# EAGLE design USB_to_NABU_Converter_v37 (EAGLE 9.7.0)
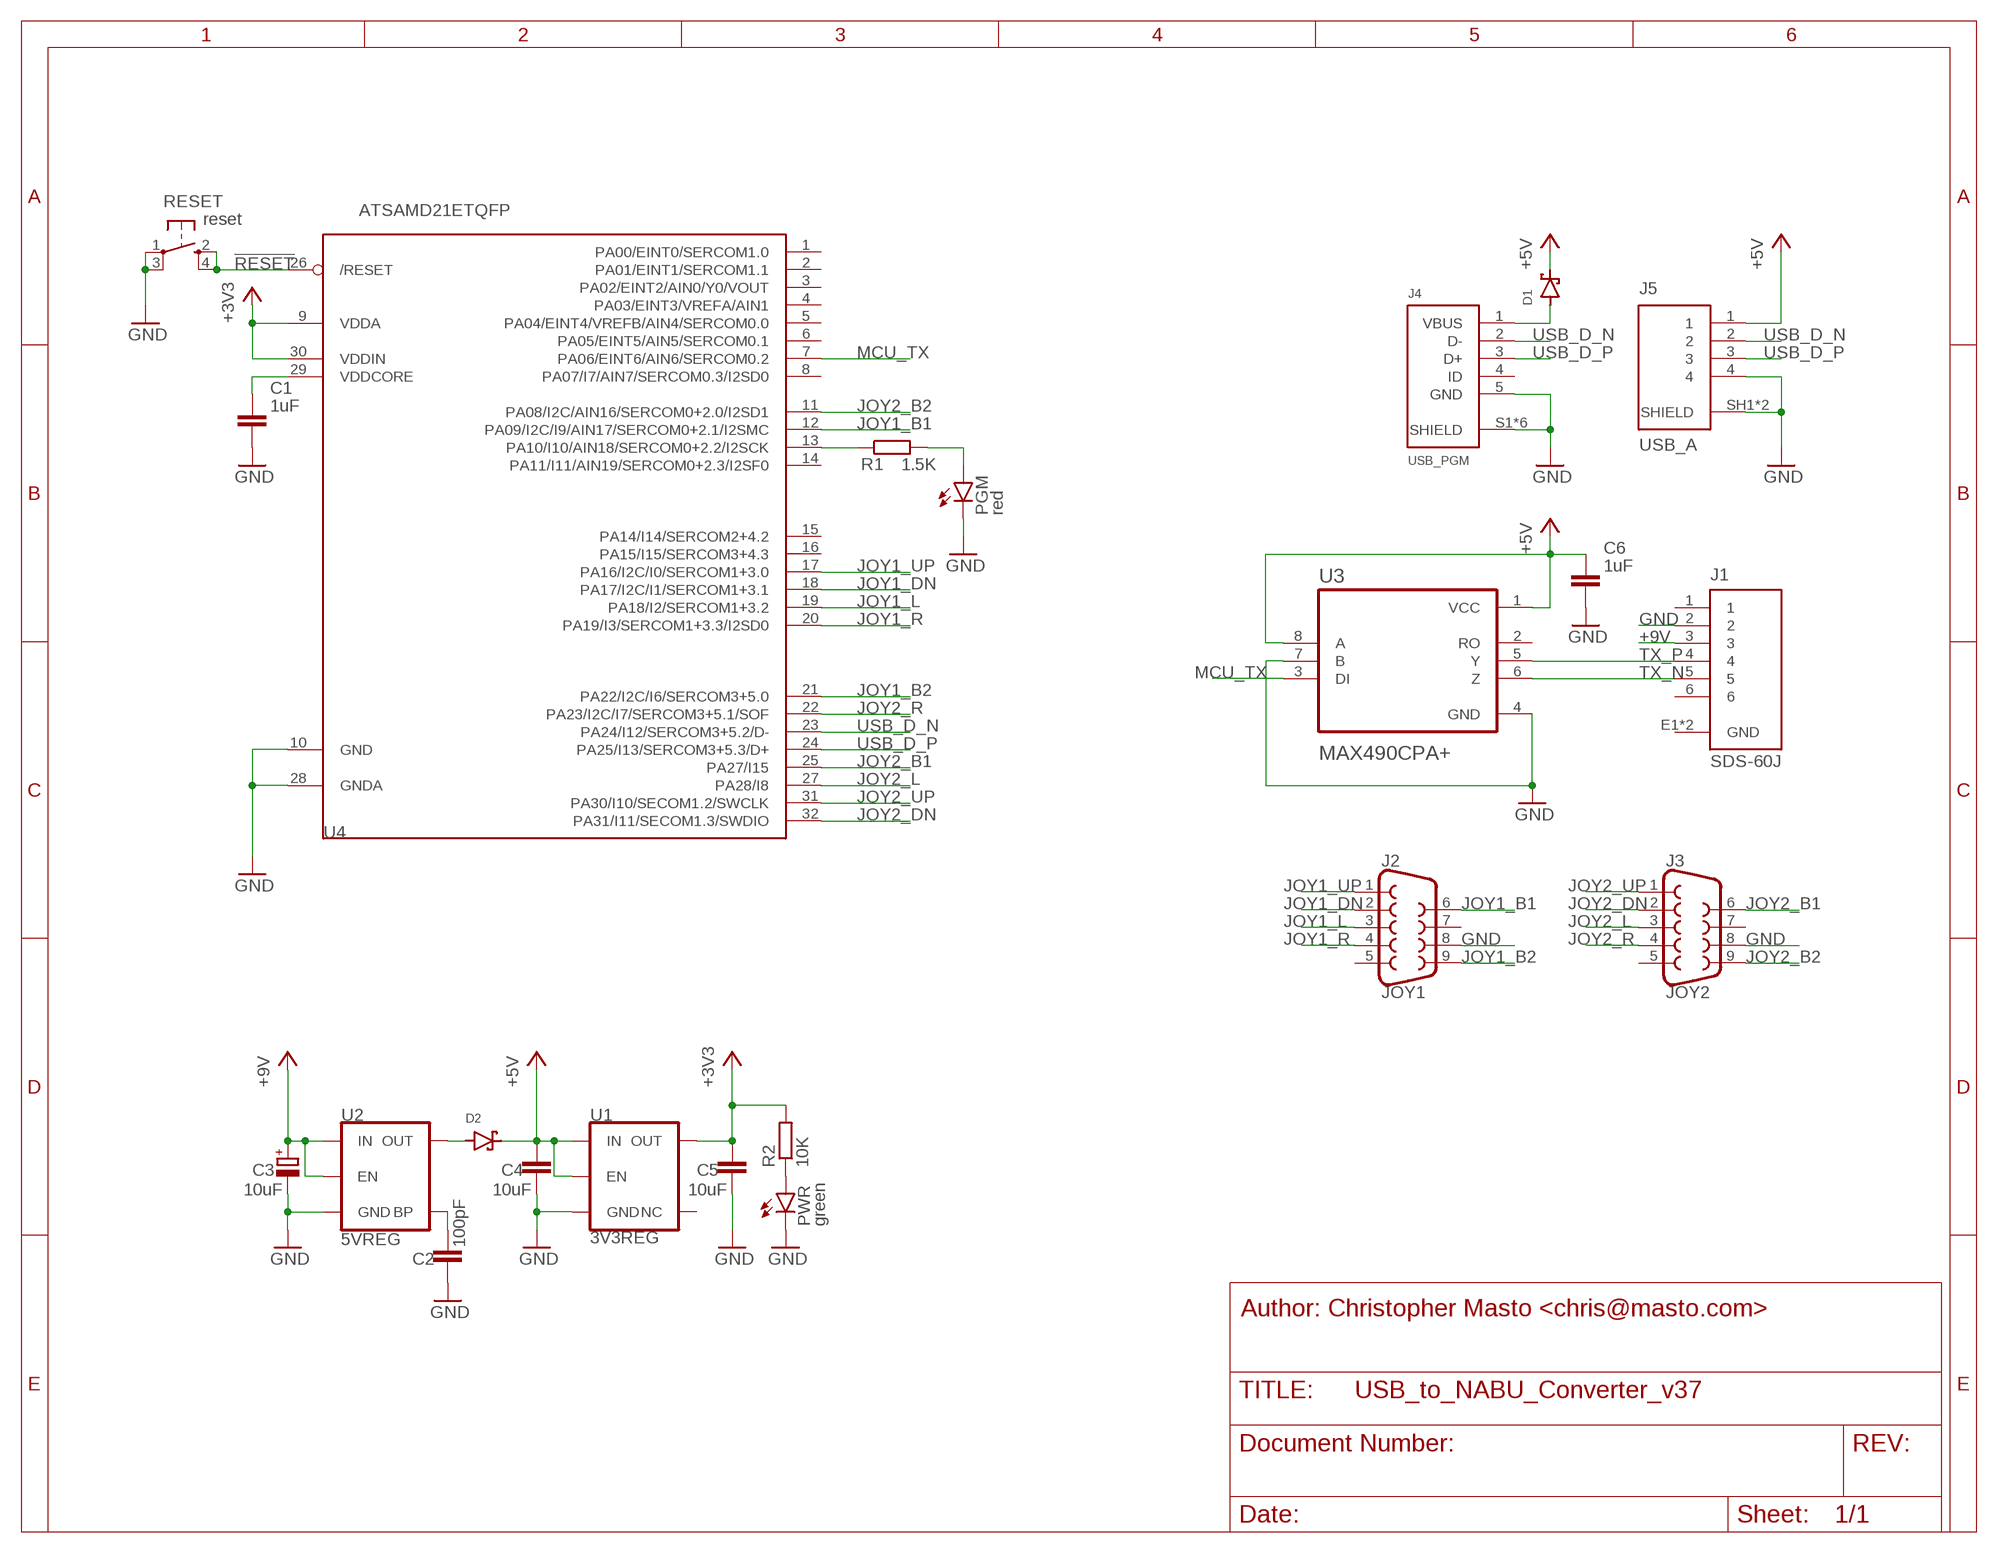
[diagram p0: schematic, sheet 1]

## Parts
C1  1uF  C_CHIP-0603(1608-METRIC)  [CAPC1608X85]
C2  100pF  C_CHIP-0603(1608-METRIC)  [CAPC1608X85]
C3  10uF  PCX1V100MCL1GS  [UD-6,3X5,8_NICHICON]
C4  10uF  C_CHIP-0603(1608-METRIC)  [CAPC1608X85]
C5  10uF  C_CHIP-0603(1608-METRIC)  [CAPC1608X85]
C6  1uF  C_CHIP-0603(1608-METRIC)  [CAPC1608X85]
D1  MBR0520LT1G  SCHOTTKY_MBR0520LT1GDO-219  [SODFL3718X115]
D2  MBR0520LT1G  SCHOTTKY_MBR0520LT1GDO-219  [SODFL3718X115]
J1  SDS-60J  [CUI_SDS-60J]
J2  JOY1  DB9MALE  [DB9_MALE]
J3  JOY2  DB9MALE  [DB9_MALE]
J4  USB_PGM  AMPHENOL_10118194-0001LF  [AMPHENOL_10118194-0001LF]
J5  USB_A  292303-1  [292303-1]
PGM  red  LEDCHIP-LED0603  [CHIP-LED0603]
PWR  green  LEDCHIP-LED0603  [CHIP-LED0603]
R1  1.5K  R-EU_R0603  [R0603]
R2  10K  R-EU_R0603  [R0603]
RESET  reset  SPST_TACT-KMR2  [KMR2]
U1  3V3REG  AP2112K  [SOT23-5]
U2  5VREG  AP2210KAP2210K  [SOT23-5]
U3  MAX490CPA+  [DIP794W47P254L991H457Q8]
U4  ATSAMD21ETQFP  [QFP80P900X900X120-32]

## Nets
!RESET: RESET.2(S) RESET.4(S1) U4.26(/RESET)
+3V3: C5.1 R2.2 U1.5(OUT) U4.9(VDDA) U4.30(VDDIN)
+5V: C4.1 C6.1 D1.1(C) D2.1(C) J5.1 U1.1(IN) U1.3(EN) U3.1(VCC) U3.8(A)
+9V: C3.+ J1.3 U2.1(IN) U2.3(EN)
GND: C1.2 C2.2 C3.- C4.2 C5.2 C6.2 J1.2 J2.8 J3.8 J4.5(GND) J4.S1(SHIELD) J4.S2(SHIELD) J4.S3(SHIELD) J4.S4(SHIELD) J4.S5(SHIELD) J4.S6(SHIELD) J5.4 J5.SH1(SHIELD) J5.SH2(SHIELD) PGM.C PWR.C RESET.1(P) RESET.3(P1) U1.2(GND) U2.2(GND) U3.4(GND) U3.7(B) U4.10(GND) U4.28(GNDA)
JOY1_B1: J2.6 U4.12(PA09/I2C/I9/AIN17/SERCOM0+2.1/I2SMC)
JOY1_B2: J2.9 U4.21(PA22/I2C/I6/SERCOM3+5.0)
JOY1_DN: J2.2 U4.18(PA17/I2C/I1/SERCOM1+3.1)
JOY1_L: J2.3 U4.19(PA18/I2/SERCOM1+3.2)
JOY1_R: J2.4 U4.20(PA19/I3/SERCOM1+3.3/I2SD0)
JOY1_UP: J2.1 U4.17(PA16/I2C/I0/SERCOM1+3.0)
JOY2_B1: J3.6 U4.25(PA27/I15)
JOY2_B2: J3.9 U4.11(PA08/I2C/AIN16/SERCOM0+2.0/I2SD1)
JOY2_DN: J3.2 U4.32(PA31/I11/SECOM1.3/SWDIO)
JOY2_L: J3.3 U4.27(PA28/I8)
JOY2_R: J3.4 U4.22(PA23/I2C/I7/SERCOM3+5.1/SOF)
JOY2_UP: J3.1 U4.31(PA30/I10/SECOM1.2/SWCLK)
MCU_TX: U3.3(DI) U4.7(PA06/EINT6/AIN6/SERCOM0.2)
N$1: PWR.A R2.1
N$2: C1.1 U4.29(VDDCORE)
N$3: R1.1 U4.13(PA10/I10/AIN18/SERCOM0+2.2/I2SCK)
N$4: PGM.A R1.2
N$5: C2.1 U2.4(BP)
N$6: D1.2(A) J4.1(VBUS)
N$7: D2.2(A) U2.5(OUT)
TX_N: J1.5 U3.6(Z)
TX_P: J1.4 U3.5(Y)
USB_D_N: J4.2(D-) J5.2 U4.23(PA24/I12/SERCOM3+5.2/D-)
USB_D_P: J4.3(D+) J5.3 U4.24(PA25/I13/SERCOM3+5.3/D+)
Unconnected: J1.1 J1.6 J2.5 J2.7 J3.5 J3.7 J4.4(ID) U1.4(NC) U3.2(RO) U4.1(PA00/EINT0/SERCOM1.0) U4.2(PA01/EINT1/SERCOM1.1) U4.3(PA02/EINT2/AIN0/Y0/VOUT) U4.4(PA03/EINT3/VREFA/AIN1) U4.5(PA04/EINT4/VREFB/AIN4/SERCOM0.0) U4.6(PA05/EINT5/AIN5/SERCOM0.1) U4.8(PA07/I7/AIN7/SERCOM0.3/I2SD0) U4.14(PA11/I11/AIN19/SERCOM0+2.3/I2SF0) U4.15(PA14/I14/SERCOM2+4.2) U4.16(PA15/I15/SERCOM3+4.3)

## Notes on the sheet
- Author: Christopher Masto <chris@masto.com>

## Power pins joined to a net without a drawn wire
GND: J1.E1(GND) J1.E2(GND)

## Library data of the parts
C1 C2 C4-C6 = Capacitor:C: Capacitor - Generic; CATEGORY: Capacitor
C3 = NABU USB Converter Parts:PCX1V100MCL1GS
D1 D2 = Diode:SCHOTTKY_: Schottky Diode - Popular parts; CATEGORY: Diode; DESCRIPTION: DIODE SCHOTTKY 20V 500MA SOD123; MANUFACTURER: ON Semiconductor; MPN: MBR0520LT1G; SUB-CATEGORY: Schottky
J1 = NABU USB Converter Parts:SDS-60J; MANUFACTURER: CUI Devices; MAXIMUM_PACKAGE_HEIGHT: 21.40mm; PARTREV: 1.06/02-13-2020; STANDARD: Manufacturer Recommendations
J2 J3 = NABU USB Converter Parts:DB9: DB9 Connector Standard DB9 (D-Sub 9) serial connector. Can be used for CAN bus as well as RS485 and RS232. Footprint production proven. Here is the female version connector we sell at SparkFun: 9 Pin Female Serial Connector - PCB Mount <https://www.sparkfun.com/products/429> (PRT-00429) This connector has been used on the following SparkFun products: SparkFun RS232 Shifter - SMD <https://www.sparkfun.com/products/449> (PRT-00449) SparkFun RS232 Shifter SMD (No DB9) <https://www.sparkfun.com/products/8780> (PRT-08780); PROD_ID: CONN-09904
J4 = NABU USB Converter Parts:AMPHENOL_10118194-0001LF: CONN RCPT USB2.0 MICRO B SMD R/A Manufacturer's datasheet <https://www.amphenol-icc.com/media/wysiwyg/files/drawing/10118194.pdf?__cf_chl_jschl_tk__=1e9b4569481076e99900b246ea640525553a7b60-1588047333-0-AZhEk6D50lwOf6CdaXmV1teudqMKHMxqtb1pEtnUtu77sOc-OVRjbCmHdORomVnr0W49D2E8XkcMdJ2SdWt5rDDYIblyJz7fSv-zilM8vQKAQDC1Z9aMVORhnMgYjPDuz8XpfDLul_eaqqFpemo1xIgoZv50WTuLMwu26ci7e02s9PWvR3z1cDqm9GMGYIPwIUd9yh5-TtN_o6DbEkadC7zoJlhYZSw-VEaYzfWnBSFg_n44fbEB3slHLR2YKLSiTmh8RSwpxKUP4gER0KeVoie9w-Ibtx3oKQbsZjrsPLGSu9BzV2nf3QeoErALCQuycvY9WhQdebLIpxaon6SXufpVIIdoKZHRpjuVVlAkUIr9oSIZGQzzOWY1-dWY48jVEOvnvoxw9-xup5uFcr7XWo0>
J5 = USB connector:292303-1: CONN RCPT USB2.0 TYPEA 4POS R/A Manufacturer's datasheet <https://www.te.com/commerce/DocumentDelivery/DDEController?Action=srchrtrv&DocNm=292303&DocType=Customer+Drawing&DocLang=English>; CREATED_BY: PCBLayout.com; DIGIKEY_PARTNO: A31726-ND; MANUFACTURER: TE Connectivity AMP Connectors; MPN: 292303-1
PGM PWR = led:LED: LED OSRAM: - CHIPLED LG R971, LG N971, LY N971, LG Q971, LY Q971, LO R971, LY R971 LH N974, LH R974 LS Q976, LO Q976, LY Q976 LO Q996 - Hyper CHIPLED LW Q18S LB Q993, LB Q99A, LB R99A - SideLED LS A670, LO A670, LY A670, LG A670, LP A670 LB A673, LV A673, LT A673, LW A673 LH A674 LY A675 LS A676, LA A676, LO A676, LY A676, LW A676 LS A679, LY A679, LG A679 - Hyper Micro SIDELED® LS Y876, LA Y876, LO Y876, LY Y876 LT Y87S - SmartLED LW L88C, LW L88S LB L89C, LB L89S, LG L890 LS L89K, LO L89K, LY L89K LS L896, LA L896, LO L896, LY L896 - TOPLED LS T670, LO T670, LY T670, LG T670, LP T670 LSG T670, LSP T670, LSY T670, LOP T670, LYG T670 LG T671, LOG T671, LSG T671 LB T673, LV T673, LT T673, LW T673 LH T674 LS T676, LA T676, LO T676, LY T676, LB T676, LH T676, LSB T676, LW T676 LB T67C, LV T67C, LT T67C, LS T67K, LO T67K, LY T67K, LW E67C LS E67B, LA E67B, LO E67B, LY E67B, LB E67C, LV E67C, LT E67C LW T67C LS T679, LY T679, LG T679 LS T770, LO T770, LY T770, LG T770, LP T770 LB T773, LV T773, LT T773, LW T773 LH T774 LS E675, LA E675, LY E675, LS T675 LS T776, LA T776, LO T776, LY T776, LB T776 LHGB T686 LT T68C, LB T68C - Hyper Mini TOPLED® LB M676 - Mini TOPLED Santana® LG M470 LS M47K, LO M47K, LY M47K Source: http://www.osram.convergy.de LUXEON: - LUMILED® LXK2-PW12-R00, LXK2-PW12-S00, LXK2-PW14-U00, LXK2-PW14-V00 LXK2-PM12-R00, LXK2-PM12-S00, LXK2-PM14-U00 LXK2-PE12-Q00, LXK2-PE12-R00, LXK2-PE12-S00, LXK2-PE14-T00, LXK2-PE14-U00 LXK2-PB12-K00, LXK2-PB12-L00, LXK2-PB12-M00, LXK2-PB14-N00, LXK2-PB14-P00, LXK2-PB14-Q00 LXK2-PR12-L00, LXK2-PR12-M00, LXK2-PR14-Q00, LXK2-PR14-R00 LXK2-PD12-Q00, LXK2-PD12-R00, LXK2-PD12-S00 LXK2-PH12-R00, LXK2-PH12-S00 LXK2-PL12-P00, LXK2-PL12-Q00, LXK2-PL12-R00 Source: www.luxeon.com KINGBRIGHT: KA-3528ASYC Source: www.kingbright.com
R1 R2 = rcl:R-EU_: RESISTOR, European symbol; SPICEPREFIX: R
RESET = NABU USB Converter Parts:SPST_TACT: SMT 6mm switch, EVQQ2 series http://www.ladyada.net/library/eagle
U1 = NABU USB Converter Parts:AP2112K
U2 = NABU USB Converter Parts:AP2210K; VALUE: 5V
U3 = MAX490CPA_:MAX490CPA+: None; AVAILABILITY: Unavailable; DESCRIPTION: MAX490 Series 2.5 Mbps 5.25 V Full Duplex RS-485/RS-422 Transceiver - PDIP-8; MF: Maxim Integrated; MP: MAX490CPA+; PACKAGE: PDIP-8 Maxim; PRICE: None
U4 = NABU USB Converter Parts:ATSAMD21E

## Board
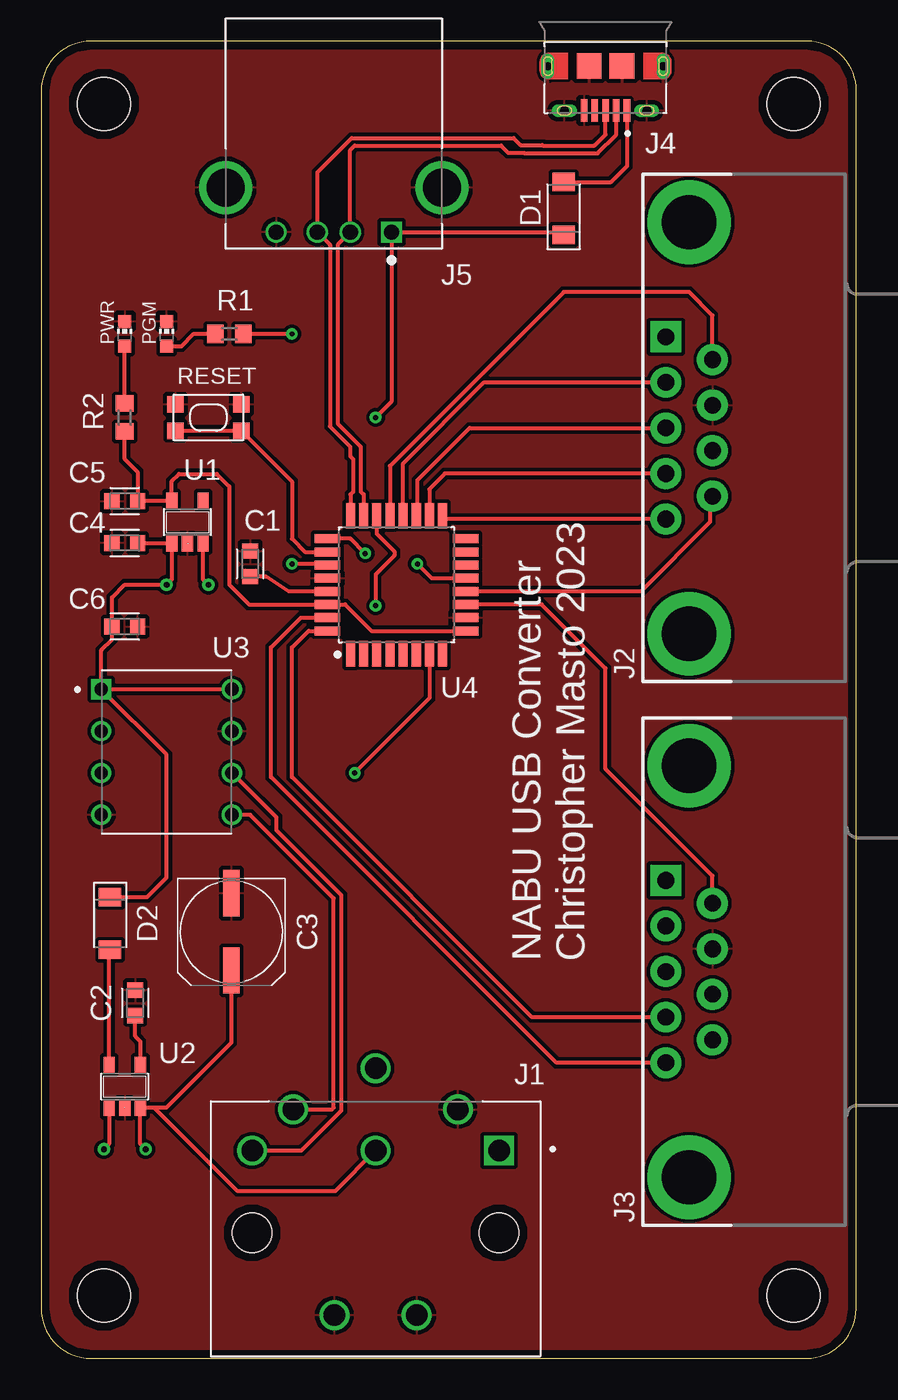
[diagram p1: board, top side]
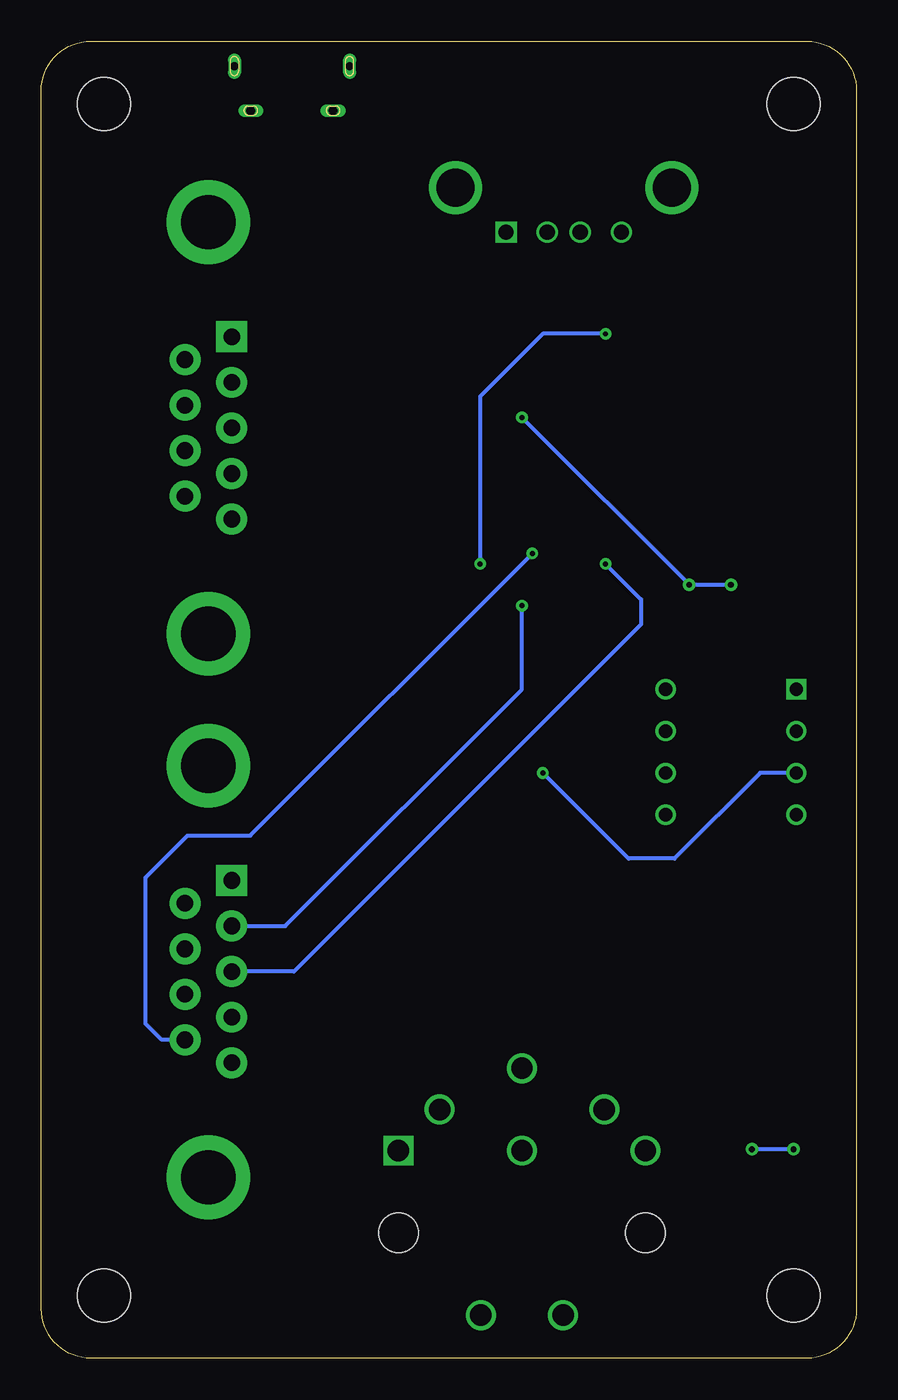
[diagram p2: board, bottom side, seen from below]

Size 49.53 x 80.01 mm. Coordinates in mm from the lower left corner, seen from the top.
Outline: 0,77.01 0,3 arc90 3,0 46.51,0 arc90 49.51,3 49.53,77.01 arc90 46.53,80.01 3,80.01 arc90 0,77.01
Copper layers (1*16): Top / Bottom
Stack-up Default Layer Stack: Top User Defined 0.035mm / Dielectric-1 User Defined 1.5mm / Bottom User Defined 0.035mm
Design rules "default(39305442-2) *": minimum track width 10mil, minimum drill 0.3mm, track to track 0.205mm, track to pad 0.205mm, pad to pad 0.205mm, via to via 0.205mm, smd to smd 8mil, copper to edge 20mil, drill to drill 8mil, minimum pad ring 4mil, minimum via ring 8mil, stop-mask expansion 4mil, vias tented up to drill 25mil, thermal gap 10mil
Holes 3.2 mm at 45.72,76.2 3.81,76.2 3.81,3.81 45.72,3.81

### Footprints (pad centres in the part's own frame; a part is rotated, then mirrored left to right if it is on the bottom)
CAPC1608X85 = smd 0.921 x 0.97: 1 -0.775,0; 2 0.775,0
UD-6,3X5,8_NICHICON = smd 2.8 x 1: + 2.35,0; - -2.35,0
SODFL3718X115 = smd 1.115 x 1.361: 1 -1.6,0; 2 1.6,0
CUI_SDS-60J = drill 1.3 square: 1 7.5,5 | drill 1.3: 2 5,7.5; 3 0,5; 4 -5,7.5; 5 -7.5,5; 6 0,10; E1 -2.5,-5; E2 2.5,-5 | hole 2.4: 7.5,0; -7.5,0
DB9_MALE = drill 1.016 pad 1.88: 1 5.54,-1.42; 2 2.77,-1.42; 3 0,-1.42; 4 -2.77,-1.42; 6 4.15,1.42; 7 1.38,1.42; 8 -1.38,1.42; 9 -4.15,1.42 | drill 1.016 pad 1.88 square: 5 -5.54,-1.42 | drill 3.302 pad 5.08: G1 -12.5,0; G2 12.5,0
AMPHENOL_10118194-0001LF = smd 0.4 x 1.35: 1 -1.3,2.7; 2 -0.65,2.7; 3 0,2.7; 4 0.65,2.7; 5 1.3,2.7 | drill 0.55 pad 0.65 long: S1 -2.5,2.7; S2 2.5,2.7 | drill 0.5 pad 0.775 long: S3 -3.5,0; S6 3.5,0 | smd 1.5 x 1.55: S4 -1,0; S5 1,0
292303-1 = drill 0.92 square: 1 -3.5,2.71 | drill 0.92: 2 -1,2.71; 3 1,2.71; 4 3.5,2.71 | drill 2.3: SH1 -6.57,0; SH2 6.57,0
CHIP-LED0603 = smd 0.8 x 0.8: A 0,-0.75; C 0,0.75
R0603 = smd 1 x 1.1: 1 -0.85,0; 2 0.85,0
KMR2 = smd 1 x 1: 1 2,0.8; 2 2,-0.8; 3 -2,0.8; 4 -2,-0.8
SOT23-5 = smd 0.69 x 0.99: 1 -0.95,-1.29; 2 0,-1.29; 3 0.95,-1.29; 4 0.95,1.3; 5 -0.95,1.3
DIP794W47P254L991H457Q8 = drill 0.81 pad 1.22 square: 1 -3.97,3.81 | drill 0.81 pad 1.22: 2 -3.97,1.27; 3 -3.97,-1.27; 4 -3.97,-3.81; 5 3.97,-3.81; 6 3.97,-1.27; 7 3.97,1.27; 8 3.97,3.81
QFP80P900X900X120-32 = smd 1.55 x 0.55: 1 -4.2,2.8; 2 -4.2,2; 3 -4.2,1.2; 4 -4.2,0.4; 5 -4.2,-0.4; 6 -4.2,-1.2; 7 -4.2,-2; 8 -4.2,-2.8; 17 4.2,-2.8; 18 4.2,-2; 19 4.2,-1.2; 20 4.2,-0.4; 21 4.2,0.4; 22 4.2,1.2; 23 4.2,2; 24 4.2,2.8 | smd 0.55 x 1.55: 9 -2.8,-4.2; 10 -2,-4.2; 11 -1.2,-4.2; 12 -0.4,-4.2; 13 0.4,-4.2; 14 1.2,-4.2; 15 2,-4.2; 16 2.8,-4.2; 25 2.8,4.2; 26 2,4.2; 27 1.2,4.2; 28 0.4,4.2; 29 -0.4,4.2; 30 -1.2,4.2; 31 -2,4.2; 32 -2.8,4.2

### Placement (x,y rotation side)
C1  12.7,48.26 90 top
C2  5.71,21.59 90 top
C3  11.56,25.91 270 top
C4  5.08,49.53 180 top
C5  5.08,52.07 180 top
C6  5.08,44.45 0 top
D1  31.75,69.85 90 top
D2  4.19,26.42 270 top
J1  20.32,7.62 0 top
J2  39.37,56.52 270 top
J3  39.37,23.5 270 top
J4  34.29,78.49 180 top
J5  17.78,71.12 180 top
PGM  7.62,62.23 0 top
PWR  5.08,62.23 0 top
R1  11.43,62.23 180 top
R2  5.08,57.15 270 top
RESET  10.16,57.15 0 top
U1  8.89,50.8 0 top
U2  5.08,16.51 0 top
U3  7.62,36.83 0 top
U4  21.59,46.99 90 top

### Tracks (layer width: path | path; a pad name or v marks a point on that pad's centre or on a via)
!RESET
  Top 0.254: U4.26 16.03,48.99 15.24,49.78 15.24,53.27 RESET.2 RESET.4
+3V3
  Top 0.254: R2.2 5.08,54.61 5.86,53.84 C5.1 5.88,52.1 U1.5 7.94,53.28 8.38,53.72 10.67,53.72 11.43,52.96 11.43,46.99 12.63,45.79 U4.30 18.47,45.79 20.07,44.19 U4.9
+5V  (via drill 0.3, 0.35)
  Top 0.254: C4.1 7.92,49.53 U1.1 7.94,47.31 v7.62,46.99 5.08,46.99 4.3,46.22 C6.1 4.3,43.67 3.65,43.02 U3.1 | U1.3 9.84,47.31 v10.16,46.99 | D2.1 6.43,28.02 7.62,29.21 7.62,36.67 U3.1 | U3.8 U3.1 | D1.1 31.59,68.41 J5.1 21.28,58.11 v20.32,57.15
  Bottom 0.254: v7.62,46.99 v10.16,46.99 v20.32,57.15
+9V  (via drill 0.35)
  Top 0.254: v6.35,12.7 6.03,13.02 U2.3 6.88,15.22 | U2.1 4.13,13.02 v3.81,12.7 | J1.3 17.86,10.16 11.94,10.16 6.88,15.22 | C3.+ 11.56,19.18 7.6,15.22 6.88,15.22
  Bottom 0.254: v3.81,12.7 v6.35,12.7
GND
  pour Top: 3,80.01 46.53,80.01 arc-90 49.53,77.01 49.51,3 arc-90 46.51,0 3,0 arc-90 0,3 0,77.01 arc-90
JOY1_B1
  Top 0.254: J2.6 40.64,52.22 40.64,50.8 36.43,46.59 U4.12
JOY1_B2
  Top 0.254: J2.9 40.79,63.35 39.37,64.77 31.75,64.77 21.19,54.21 U4.21
JOY1_DN
  Top 0.254: J2.2 24.54,53.74 23.59,52.8 U4.18
JOY1_L
  Top 0.254: U4.19 22.86,51.26 22.86,53.34 26.04,56.52 J2.3
JOY1_R
  Top 0.254: U4.20 21.99,54.36 26.91,59.28 J2.4
JOY1_UP
  Top 0.254: J2.1 24.61,50.98 U4.17
JOY2_B1  (via drill 0.3)
  Top 0.254: v19.68,48.9 18.79,49.79 U4.25
  Bottom 0.254: J3.6 42.2,19.34 43.18,20.32 43.18,29.21 40.64,31.75 36.83,31.75 v19.68,48.9
JOY2_B2
  Top 0.254: J3.9 40.79,29.31 34.29,35.81 34.29,41.91 30.41,45.79 U4.11
JOY2_DN
  Top 0.254: J3.2 29.82,20.73 15.24,35.31 15.24,43.18 16.25,44.19 U4.32
JOY2_L  (via drill 0.3)
  Top 0.254: v15.24,48.26 17.32,48.26 U4.27
  Bottom 0.254: v15.24,48.26 13.08,46.1 13.08,44.58 34.16,23.5 J3.3
JOY2_R  (via drill 0.3)
  Top 0.254: v20.32,45.72 20.32,47.62 21.46,48.77 21.46,49.02 20.39,50.09 U4.22
  Bottom 0.254: v20.32,45.72 20.32,40.64 34.7,26.27 J3.4
JOY2_UP
  Top 0.254: J3.1 31.32,17.95 13.97,35.31 13.97,43.18 15.78,44.99 U4.31
MCU_TX  (via drill 0.3)
  Top 0.254: U4.7 23.59,40.1 v19.05,35.56
  Bottom 0.254: v19.05,35.56 13.84,30.35 11.05,30.35 5.84,35.56 U3.3
N$1
  Top 0.254: R2.1 PWR.A
N$2
  Top 0.254: C1.1 13.67,47.48 15.03,46.59 U4.29
N$3  (via drill 0.3)
  Top 0.254: R1.1 v15.24,62.23 | v22.86,48.26 23.73,47.39 U4.13
  Bottom 0.254: v15.24,62.23 19.05,62.23 22.86,58.42 v22.86,48.26
N$4
  Top 0.254: PGM.A 8.52,61.48 9.27,62.23 R1.2
N$5
  Top 0.254: U2.4 6.03,19.24 5.71,19.56 C2.1
N$6
  Top 0.254: D1.2 34.62,71.45 35.59,72.42 J4.1
N$7
  Top 0.254: U2.5 4.13,24.75 D2.2
TX_N
  Top 0.254: U3.6 14.29,32.85 14.29,32.08 16.84,29.54 16.97,29.4 18.24,28.13 18.24,15.05 15.81,12.62 J1.5
TX_P
  Top 0.254: U3.5 12.7,33.02 17.78,27.94 17.78,15.24 17.66,15.12 J1.4
USB_D_N
  Top 0.254: U4.23 19.59,52.47 19.42,52.64 19.42,55.38 18.01,56.79 18.01,67.64 J5.2 18.78,73.39 19.05,73.66 27.94,73.66 28.37,73.23 29.35,73.23 29.38,73.2 33.8,73.2 34.94,74.34 J4.2
USB_D_P
  Top 0.254: U4.24 18.79,52.47 18.96,52.64 18.96,54.61 18.77,54.8 18.77,55.38 17.55,56.6 17.55,67.64 J5.3 16.78,72.04 18.86,74.12 28.7,74.12 29.12,73.69 30.45,73.69 30.48,73.66 33.61,73.66 34.29,74.34 J4.3

### Text on the board
tPlace: NABU USB Converter / Christopher Masto 2023